# EAGLE schematic wirelessSensor 0.1 (EAGLE 7.7.0)
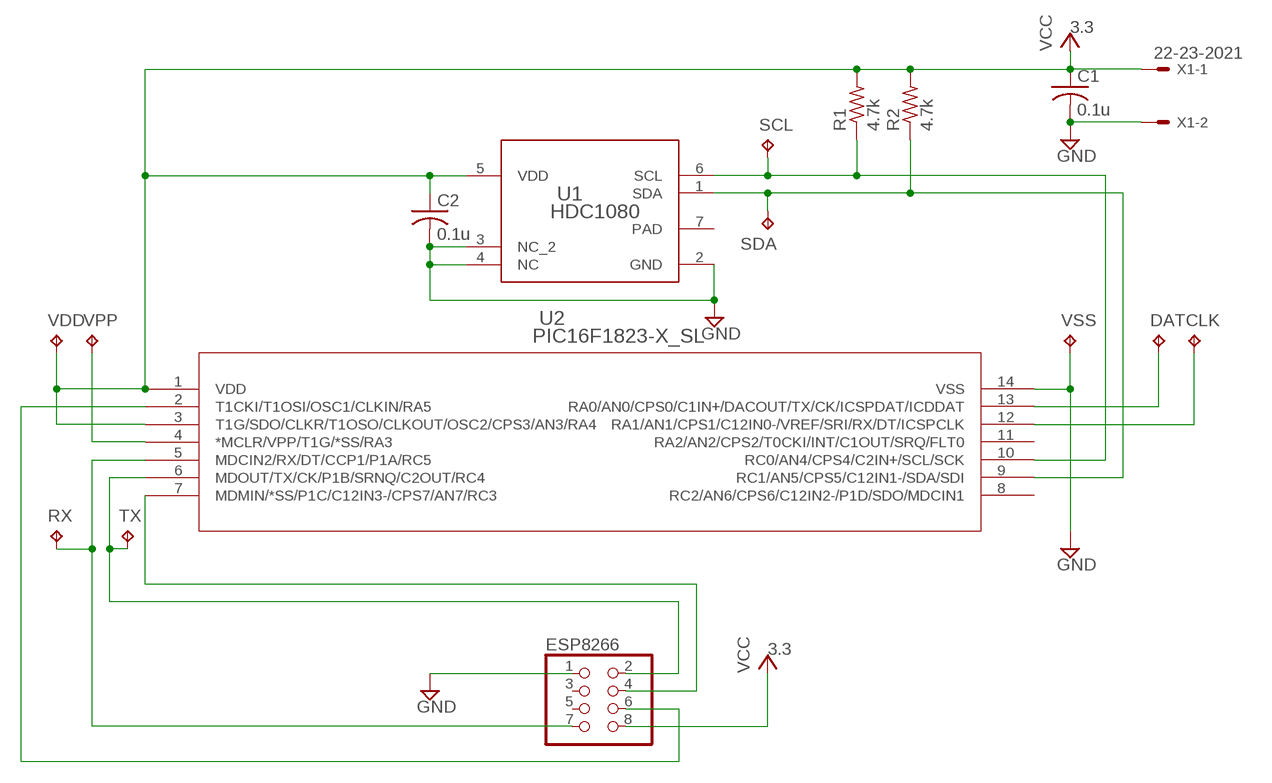
[diagram p0: schematic, sheet 1]

## Parts
C1  0.1u  C-USC0603  [C0603]
C2  0.1u  C-USC0603  [C0603]
CLK  TPB1,27  [B1,27]
DAT  TPB1,27  [B1,27]
ESP8266  PINHD-2X4  [2X04]
R1  4.7k  R-US_R0603  [R0603]
R2  4.7k  R-US_R0603  [R0603]
RX  TPB1,27  [B1,27]
SCL  TPB1,27  [B1,27]
SDA  TPB1,27  [B1,27]
TX  TPB1,27  [B1,27]
U1  HDC1080  HDC1080DMBR  [DMB0006A]
U2  PIC16F1823-X_SL  [SOIC14-N_MC]
VDD  TPB1,27  [B1,27]
VPP  TPB1,27  [B1,27]
VSS  TPB1,27  [B1,27]
X1  22-23-2021  [22-23-2021]

## Nets
GND: C1.2 C2.2 ESP8266.1 U1.2(GND) U1.3(NC_2) U1.4(NC) U2.14(VSS) VSS.TP X1.2
N$1: ESP8266.2 TX.TP U2.6(MDOUT/TX/CK/P1B/SRNQ/C2OUT/RC4)
N$2: R1.1 SCL.TP U1.6(SCL) U2.10(RC0/AN4/CPS4/C2IN+/SCL/SCK)
N$3: R2.1 SDA.TP U1.1(SDA) U2.9(RC1/AN5/CPS5/C12IN1-/SDA/SDI)
N$4: U2.4(*MCLR/VPP/T1G/*SS/RA3) VPP.TP
N$5: DAT.TP U2.13(RA0/AN0/CPS0/C1IN+/DACOUT/TX/CK/ICSPDAT/ICDDAT)
N$6: CLK.TP U2.12(RA1/AN1/CPS1/C12IN0-/VREF/SRI/RX/DT/ICSPCLK)
N$7: ESP8266.7 RX.TP U2.5(MDCIN2/RX/DT/CCP1/P1A/RC5)
N$8: ESP8266.4 U2.7(MDMIN/*SS/P1C/C12IN3-/CPS7/AN7/RC3)
N$9: ESP8266.6 U2.2(T1CKI/T1OSI/OSC1/CLKIN/RA5)
VCC: C1.1 C2.1 ESP8266.8 R1.2 R2.2 U1.5(VDD) U2.1(VDD) U2.3(T1G/SDO/CLKR/T1OSO/CLKOUT/OSC2/CPS3/AN3/RA4) VDD.TP X1.1
Unconnected: ESP8266.3 ESP8266.5 U2.8(RC2/AN6/CPS6/C12IN2-/P1D/SDO/MDCIN1) U2.11(RA2/AN2/CPS2/T0CKI/INT/C1OUT/SRQ/FLT0)

## Power pins joined to a net without a drawn wire
PAD: U1.7(PAD)

## Library data of the parts
C1 C2 = rcl:C-US: CAPACITOR, American symbol
CLK DAT RX SCL SDA TX VDD VPP VSS = testpad:TP: Test pad
ESP8266 = pinhead:PINHD-2X4: PIN HEADER
R1 R2 = rcl:R-US_: RESISTOR, American symbol
U1 = wirelessSensor:HDC1080DMBR; ALTERNATEPARTNUMBER: HDC1080DMBT; APPLICATION_BUILDNUMBER: *; COMPTYPE: IC; MANUFACTURER: Texas Instruments; MOUNTTYPE: SMT; PACKAGEREFERENCE: DMB0006A; PARTNUMBER: HDC1080DMBR; PIN_COUNT: 7; REFDES: RefDes; TYPE: TYPE; VALUE: Value
U2 = wirelessSensor:PIC16F1823-X_SL
X1 = con-molex:22-23-2021: .100" (2.54mm) Center Header - 2 Pin; MF: MOLEX; MPN: 22-23-2021; OC_FARNELL: 1462926; OC_NEWARK: 25C3832